# EAGLE design 2mbsimm (EAGLE 8.0.1)
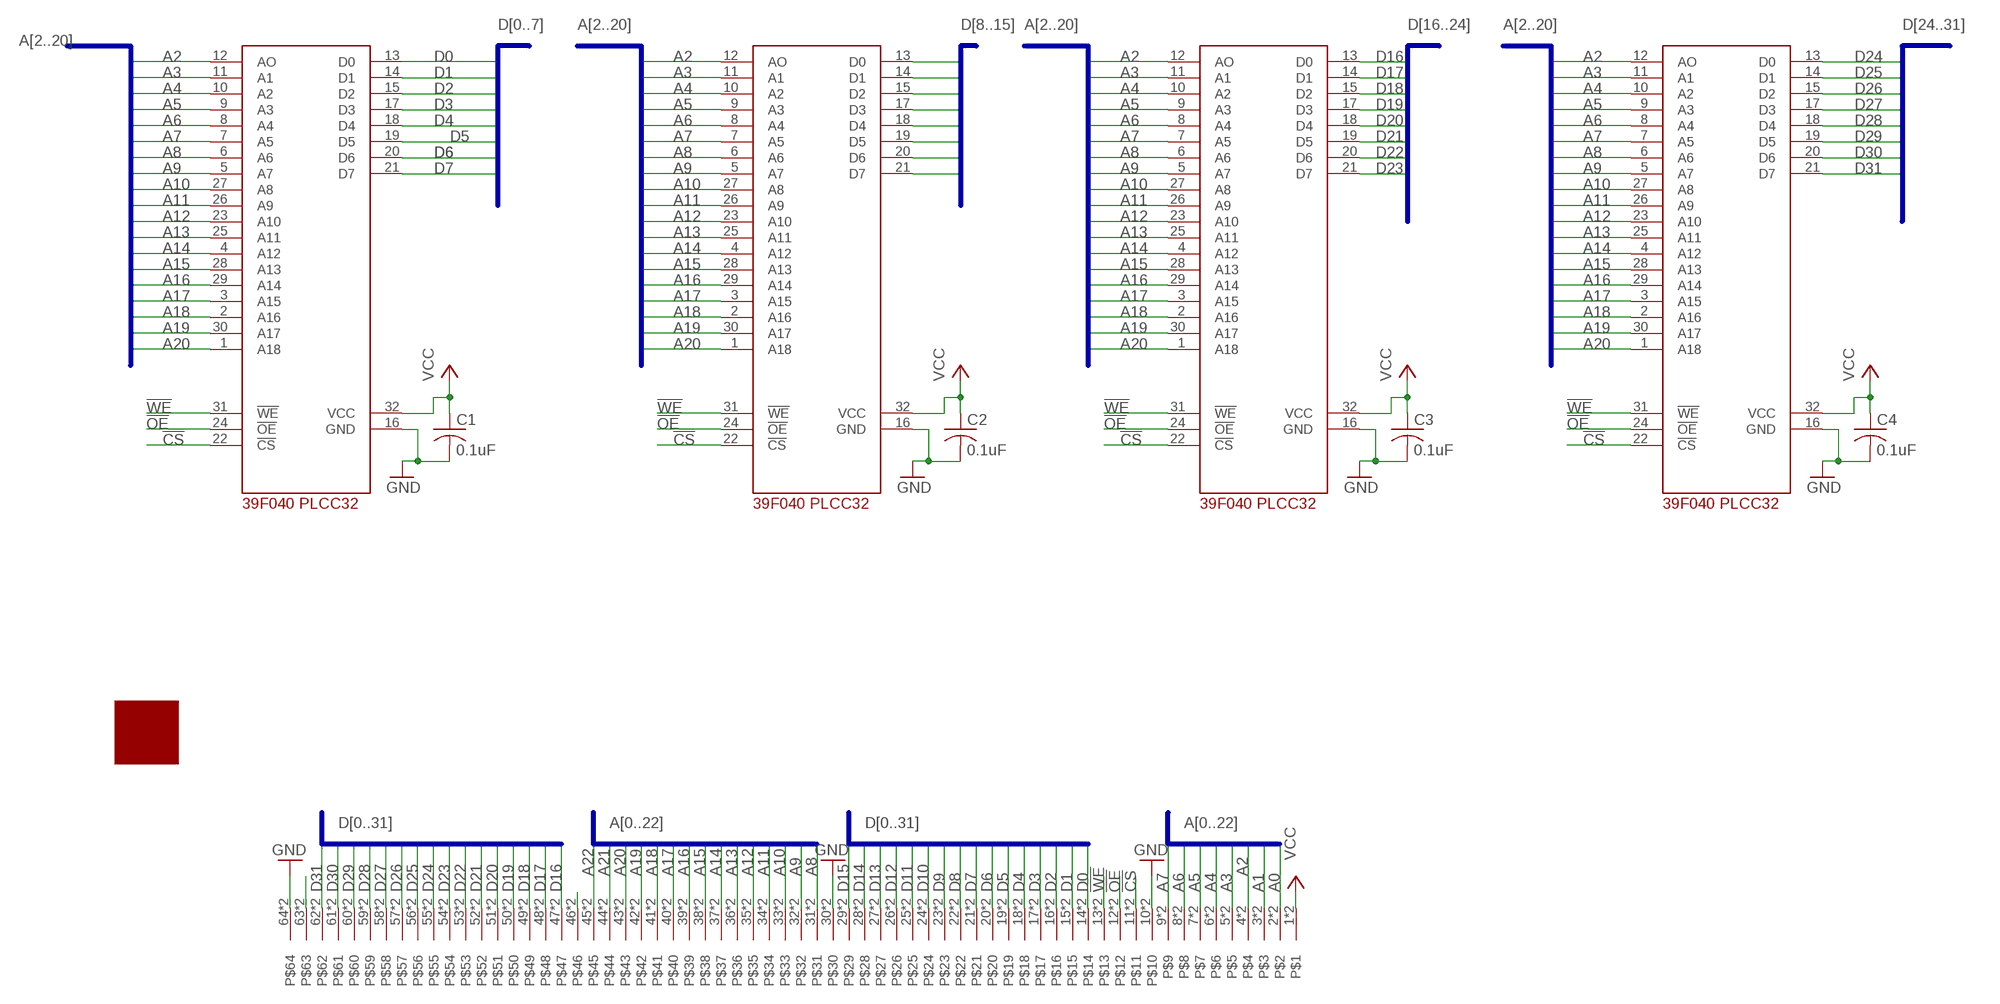
[diagram p0: schematic, sheet 1]

## Parts
C1  0.1uF  C-USC1206  [C1206]
C2  0.1uF  C-USC1206  [C1206]
C3  0.1uF  C-USC1206  [C1206]
C4  0.1uF  C-USC1206  [C1206]
CON1  MYSIMM  [SIMM64L]
U$1  39F040-PLCC-SOCKET  [PLCC-32-SMT-TT]
U$2  39F040-PLCC-SOCKET  [PLCC-32-SMT-TT]
U$3  39F040-PLCC-SOCKET  [PLCC-32-SMT-TT]
U$4  39F040-PLCC-SOCKET  [PLCC-32-SMT-TT]
U$5  LOGO  [LOGO]

## Nets
!CS: CON1.11 CON1.75 U$1.22(!CS) U$2.22(!CS) U$3.22(!CS) U$4.22(!CS)
!OE: CON1.12 CON1.76 U$1.24(!OE) U$2.24(!OE) U$3.24(!OE) U$4.24(!OE)
!WE: CON1.13 CON1.77 U$1.31(!WE) U$2.31(!WE) U$3.31(!WE) U$4.31(!WE)
A0: CON1.2 CON1.66
A1: CON1.3 CON1.67
A2: CON1.4 CON1.68 U$1.12(AO) U$2.12(AO) U$3.12(AO) U$4.12(AO)
A3: CON1.5 CON1.69 U$1.11(A1) U$2.11(A1) U$3.11(A1) U$4.11(A1)
A4: CON1.6 CON1.70 U$1.10(A2) U$2.10(A2) U$3.10(A2) U$4.10(A2)
A5: CON1.7 CON1.71 U$1.9(A3) U$2.9(A3) U$3.9(A3) U$4.9(A3)
A6: CON1.8 CON1.72 U$1.8(A4) U$2.8(A4) U$3.8(A4) U$4.8(A4)
A7: CON1.9 CON1.73 U$1.7(A5) U$2.7(A5) U$3.7(A5) U$4.7(A5)
A8: CON1.31 CON1.95 U$1.6(A6) U$2.6(A6) U$3.6(A6) U$4.6(A6)
A9: CON1.32 CON1.96 U$1.5(A7) U$2.5(A7) U$3.5(A7) U$4.5(A7)
A10: CON1.33 CON1.97 U$1.27(A8) U$2.27(A8) U$3.27(A8) U$4.27(A8)
A11: CON1.34 CON1.98 U$1.26(A9) U$2.26(A9) U$3.26(A9) U$4.26(A9)
A12: CON1.35 CON1.99 U$1.23(A10) U$2.23(A10) U$3.23(A10) U$4.23(A10)
A13: CON1.36 CON1.100 U$1.25(A11) U$2.25(A11) U$3.25(A11) U$4.25(A11)
A14: CON1.37 CON1.101 U$1.4(A12) U$2.4(A12) U$3.4(A12) U$4.4(A12)
A15: CON1.38 CON1.102 U$1.28(A13) U$2.28(A13) U$3.28(A13) U$4.28(A13)
A16: CON1.39 CON1.103 U$1.29(A14) U$2.29(A14) U$3.29(A14) U$4.29(A14)
A17: CON1.40 CON1.104 U$1.3(A15) U$2.3(A15) U$3.3(A15) U$4.3(A15)
A18: CON1.41 CON1.105 U$1.2(A16) U$2.2(A16) U$3.2(A16) U$4.2(A16)
A19: CON1.42 CON1.106 U$1.30(A17) U$2.30(A17) U$3.30(A17) U$4.30(A17)
A20: CON1.43 CON1.107 U$1.1(A18) U$2.1(A18) U$3.1(A18) U$4.1(A18)
A21: CON1.44 CON1.108
A22: CON1.45 CON1.109
D0: CON1.14 CON1.78 U$1.13(D0)
D1: CON1.15 CON1.79 U$1.14(D1)
D2: CON1.16 CON1.80 U$1.15(D2)
D3: CON1.17 CON1.81 U$1.17(D3)
D4: CON1.18 CON1.82 U$1.18(D4)
D5: CON1.19 CON1.83 U$1.19(D5)
D6: CON1.20 CON1.84 U$1.20(D6)
D7: CON1.21 CON1.85 U$1.21(D7)
D8: CON1.22 CON1.86 U$2.13(D0)
D9: CON1.23 CON1.87 U$2.14(D1)
D10: CON1.24 CON1.88 U$2.15(D2)
D11: CON1.25 CON1.89 U$2.17(D3)
D12: CON1.26 CON1.90 U$2.18(D4)
D13: CON1.27 CON1.91 U$2.19(D5)
D14: CON1.28 CON1.92 U$2.20(D6)
D15: CON1.29 CON1.93 U$2.21(D7)
D16: CON1.47 CON1.111 U$3.13(D0)
D17: CON1.48 CON1.112 U$3.14(D1)
D18: CON1.49 CON1.113 U$3.15(D2)
D19: CON1.50 CON1.114 U$3.17(D3)
D20: CON1.51 CON1.115 U$3.18(D4)
D21: CON1.52 CON1.116 U$3.19(D5)
D22: CON1.53 CON1.117 U$3.20(D6)
D23: CON1.54 CON1.118 U$3.21(D7)
D24: CON1.55 CON1.119 U$4.13(D0)
D25: CON1.56 CON1.120 U$4.14(D1)
D26: CON1.57 CON1.121 U$4.15(D2)
D27: CON1.58 CON1.122 U$4.17(D3)
D28: CON1.59 CON1.123 U$4.18(D4)
D29: CON1.60 CON1.124 U$4.19(D5)
D30: CON1.61 CON1.125 U$4.20(D6)
D31: CON1.62 CON1.126 U$4.21(D7)
GND [thicker]: C1.2 C2.2 C3.2 C4.2 CON1.10 CON1.30 CON1.64 CON1.74 CON1.94 CON1.128 U$1.16(GND) U$2.16(GND) U$3.16(GND) U$4.16(GND)
N$1 [thicker]: CON1.46 CON1.110
UNUSED3: CON1.63 CON1.127
VCC [thicker]: C1.1 C2.1 C3.1 C4.1 CON1.1 CON1.65 U$1.32(VCC) U$2.32(VCC) U$3.32(VCC) U$4.32(VCC)

## Buses
A[0..22]
D[0..31]
A[2..20]
D[0..7]
D[8..15]
D[16..24]
D[24..31]

## Library data of the parts
C1-C4 = resistor:C-US: CAPACITOR, American symbol
CON1 = Doug:MYSIMM: 64-Pin SIMM
U$1-U$4 = capstuff:39F040-PLCC-SOCKET: 4MB Flash in Plcc socket
U$5 = capstuff:LOGO

## Net classes
0 default: width 0.178 mm, drill 0.305 mm, clearance 0.178 mm
1 thicker: width 0.305 mm, drill 0.305 mm, clearance 0.178 mm

## Board
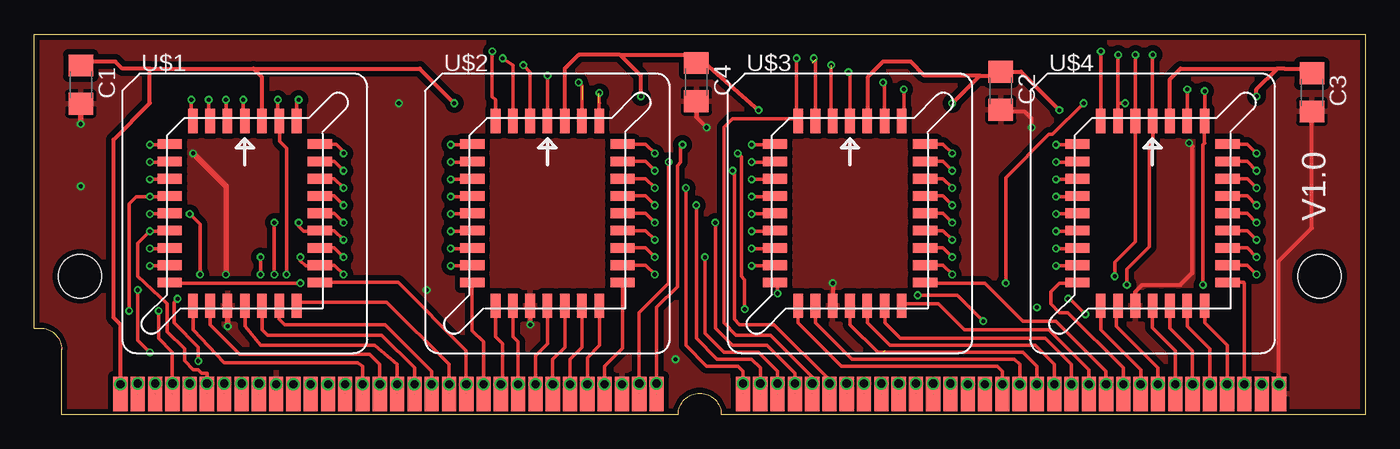
[diagram p1: board, top side]
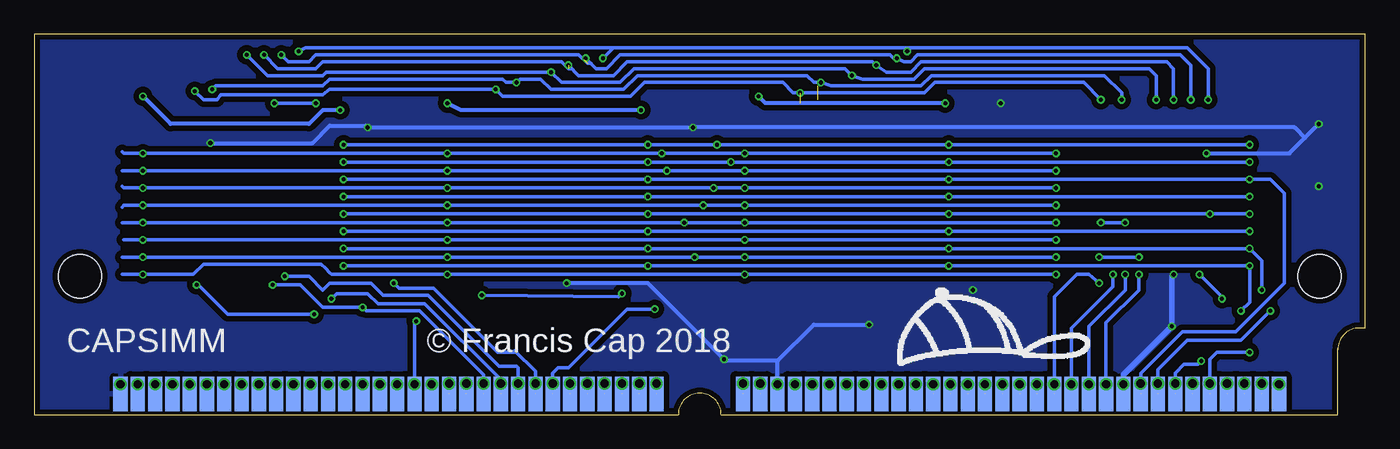
[diagram p2: board, bottom side, seen from below]

Size 97.79 x 27.94 mm. Coordinates in mm from the lower left corner, seen from the top.
Copper layers (1*16): Top 0.035559375mm / dielectric 1.6mm / Bottom 0.035559375mm
Design rules "oshpark-2layer": minimum track width 6mil, minimum drill 10mil, track to track 6mil, track to pad 6mil, pad to pad 6mil, via to via 6mil, smd to smd 6mil, copper to edge 15mil, drill to drill 6mil, minimum pad ring 5mil, minimum via ring 5mil, stop-mask expansion 2.5mil, vias tented up to drill 0mil, thermal gap 10mil

### Footprints (pad centres in the part's own frame; a part is rotated, then mirrored left to right if it is on the bottom)
C1206 = smd 1.6 x 1.8: 1 -1.4,0; 2 1.4,0
SIMM64L = smd 1.041 x 2.54: 1 -42.545,-8.636; 2 -41.275,-8.636; 3 -40.005,-8.636; 4 -38.735,-8.636; 5 -37.465,-8.636; 6 -36.195,-8.636; 7 -34.925,-8.636; 8 -33.655,-8.636; 9 -32.385,-8.636; 10 -31.115,-8.636; 11 -29.845,-8.636; 12 -28.575,-8.636; 13 -27.305,-8.636; 14 -26.035,-8.636; 15 -24.765,-8.636; 16 -23.495,-8.636; 17 -22.225,-8.636; 18 -20.955,-8.636; 19 -19.685,-8.636; 20 -18.415,-8.636; 21 -17.145,-8.636; 22 -15.875,-8.636; 23 -14.605,-8.636; 24 -13.335,-8.636; 25 -12.065,-8.636; 26 -10.795,-8.636; 27 -9.525,-8.636; 28 -8.255,-8.636; 29 -6.985,-8.636; 30 -5.715,-8.636; 31 -4.445,-8.636; 32 -3.175,-8.636; 33 3.175,-8.636; 34 4.445,-8.636; 35 5.715,-8.636; 36 6.985,-8.636; 37 8.255,-8.636; 38 9.525,-8.636; 39 10.795,-8.636; 40 12.065,-8.636; 41 13.335,-8.636; 42 14.605,-8.636; 43 15.875,-8.636; 44 17.145,-8.636; 45 18.415,-8.636; 46 19.685,-8.636; 47 20.955,-8.636; 48 22.225,-8.636; 49 23.495,-8.636; 50 24.765,-8.636; 51 26.035,-8.636; 52 27.305,-8.636; 53 28.575,-8.636; 54 29.845,-8.636; 55 31.115,-8.636; 56 32.385,-8.636; 57 33.655,-8.636; 58 34.925,-8.636; 59 36.195,-8.636; 60 37.465,-8.636; 61 38.735,-8.636; 62 40.005,-8.636; 63 41.275,-8.636; 64 42.545,-8.636 | smd 1.041 x 2.54 bottom: 65 -42.545,-8.636; 66 -41.275,-8.636; 67 -40.005,-8.636; 68 -38.735,-8.636; 69 -37.465,-8.636; 70 -36.195,-8.636; 71 -34.925,-8.636; 72 -33.655,-8.636; 73 -32.385,-8.636; 74 -31.115,-8.636; 75 -29.845,-8.636; 76 -28.575,-8.636; 77 -27.305,-8.636; 78 -26.035,-8.636; 79 -24.765,-8.636; 80 -23.495,-8.636; 81 -22.225,-8.636; 82 -20.955,-8.636; 83 -19.685,-8.636; 84 -18.415,-8.636; 85 -17.145,-8.636; 86 -15.875,-8.636; 87 -14.605,-8.636; 88 -13.335,-8.636; 89 -12.065,-8.636; 90 -10.795,-8.636; 91 -9.525,-8.636; 92 -8.255,-8.636; 93 -6.985,-8.636; 94 -5.715,-8.636; 95 -4.445,-8.636; 96 -3.175,-8.636; 97 3.175,-8.636; 98 4.445,-8.636; 99 5.715,-8.636; 100 6.985,-8.636; 101 8.255,-8.636; 102 9.525,-8.636; 103 10.795,-8.636; 104 12.065,-8.636; 105 13.335,-8.636; 106 14.605,-8.636; 107 15.875,-8.636; 108 17.145,-8.636; 109 18.415,-8.636; 110 19.685,-8.636; 111 20.955,-8.636; 112 22.225,-8.636; 113 23.495,-8.636; 114 24.765,-8.636; 115 26.035,-8.636; 116 27.305,-8.636; 117 28.575,-8.636; 118 29.845,-8.636; 119 31.115,-8.636; 120 32.385,-8.636; 121 33.655,-8.636; 122 34.925,-8.636; 123 36.195,-8.636; 124 37.465,-8.636; 125 38.735,-8.636; 126 40.005,-8.636; 127 41.275,-8.636; 128 42.545,-8.636 | hole 3.175: 45.517,0; -45.517,0
PLCC-32-SMT-TT = smd 0.71 x 1.78: 1 0,6.785; 2 -1.27,6.785; 3 -2.54,6.785; 4 -3.81,6.785; 14 -3.81,-6.785; 15 -2.54,-6.785; 16 -1.27,-6.785; 17 0,-6.785; 18 1.27,-6.785; 19 2.54,-6.785; 20 3.81,-6.785; 30 3.81,6.785; 31 2.54,6.785; 32 1.27,6.785 | smd 1.78 x 0.71: 5 -5.515,5.08; 6 -5.515,3.81; 7 -5.515,2.54; 8 -5.515,1.27; 9 -5.515,0; 10 -5.515,-1.27; 11 -5.515,-2.54; 12 -5.515,-3.81; 13 -5.515,-5.08; 21 5.515,-5.08; 22 5.515,-3.81; 23 5.515,-2.54; 24 5.515,-1.27; 25 5.515,0; 26 5.515,1.27; 27 5.515,2.54; 28 5.515,3.81; 29 5.515,5.08

### Placement (x,y rotation side)
C1  3.44,24.23 270 top
C2  71,23.78 270 top
C3  93.86,23.65 270 top
C4  48.65,24.42 270 top
CON1  48.9,10.16 0 top
U$1  15.48,14.78 0 top
U$2  37.7,14.78 0 top
U$3  59.93,14.78 0 top
U$4  82.15,14.78 0 top
U$5  34.42,3.56 0 bottom

### Tracks (layer width: path | path; a pad name or v marks a point on that pad's centre or on a via)
!CS  (via drill 0.3 pad 0.25, 0.6)
  Top 0.254: v22.73,10.29 22.05,10.97 U$1.22 20.95,10.92 19.94,10.92 19.56,11.3 v19.56,11.56 | U$2.22 44.91,10.97 v45.59,10.29 | U$3.22 66.75,10.97 v67.44,10.29 | U$4.22 89.11,10.97 v89.79,10.29 | v16.64,10.29 v16.64,11.56
  Top 0.406: CON1.75 v19.05,2.22
  Bottom 0.254: v22.73,10.29 v45.59,10.29 v67.44,10.29 75.95,10.29 76.07,10.41 76.39,10.73 76.71,11.05 85.34,11.05 86.11,10.29 v89.79,10.29 91.31,10.29 | CON1.75 19.05,6.73 16.64,9.14 v16.64,10.29 | v16.64,11.56 v19.56,11.56
  Bottom 0.305: v19.05,2.22 CON1.75
!OE  (via drill 0.3 pad 0.25, 0.6)
  Top 0.178: 20.16,2.38 v20.32,2.22
  Top 0.254: v22.73,12.83 22.05,13.51 U$1.24 20.95,13.46 19.81,13.46 19.43,13.84 v19.43,14.1 | U$2.24 44.91,13.51 v45.59,12.83 | U$3.24 66.75,13.51 v67.44,12.83 | U$4.24 89.11,13.51 v89.79,12.83 | v17.65,10.29 v17.65,14.1
  Top 0.406: CON1.76 v20.32,2.22
  Bottom 0.178: v20.32,2.22 20.32,2.54
  Bottom 0.254: v22.73,12.83 v45.59,12.83 v67.44,12.83 v89.79,12.83 91.19,12.83 | CON1.76 20.32,6.48 17.65,9.14 v17.65,10.29 | v17.65,14.1 v19.43,14.1
  Bottom 0.305: v20.32,2.22 CON1.76
!WE  (via drill 0.3 pad 0.25, 0.6)  (1 unrouted)
  Top 0.254: v17.91,23.11 17.91,21.68 U$1.31 18.03,21.55 18.03,20.07 18.54,19.56 v18.54,10.29 | v40.01,24.38 40.26,24.13 40.26,21.58 U$2.31 | 40.26,22.86 40.24,23.1 | U$3.31 62.47,24.27 v62.36,24.38 | 84.71,21.58 U$4.31 84.71,21.58 | v84.71,23.88 84.71,21.58
  Top 0.406: CON1.77 v21.59,2.22
  Bottom 0.254: v21.59,2.22 21.72,2.35 | v17.91,23.11 17.91,23.62 19.18,24.89 31.88,24.89 32.64,24.13 39.24,24.13 v40.01,24.38 40.51,24.38 41.02,24.89 53.47,24.89 54.48,23.88 59.82,23.88 60.58,24.64 62.1,24.64 v62.36,24.38 63.12,24.38 63.37,24.64 76.07,24.64 76.58,24.13 84.46,24.13 v84.71,23.88 | CON1.77 21.59,6.35 18.54,9.4 v18.54,10.29
  Bottom 0.305: v21.59,2.22 CON1.77
A0  (1 unrouted)
A1  (1 unrouted)
A2  (via drill 0.3 pad 0.25, 0.6 pad 0.25)  (1 unrouted)
  Top 0.254: U$1.12 9.92,10.92 v8.51,10.92 | U$2.12 32.14,10.92 v30.61,10.92 | U$3.12 54.41,10.92 v52.71,10.92 | U$4.12 76.64,10.92 v75.06,10.92 | CON1.4 v10.16,2.29 10.16,4.57 9.14,5.59 v9.14,7.62
  Bottom 0.254: 8.51,10.67 v8.51,10.92 | v8.51,10.92 v30.61,10.92 | v30.61,10.92 31.37,10.92 | v30.61,10.92 v52.71,10.92 v75.06,10.92 | v8.51,10.92 8.51,8.26 v9.14,7.62
A3  (via drill 0.3 pad 0.25, 0.6 pad 0.25)  (1 unrouted)
  Top 0.254: U$1.11 9.92,12.19 v8.51,12.19 | U$2.11 32.14,12.19 v30.61,12.19 | U$3.11 54.41,12.19 v52.71,12.19 | U$4.11 76.64,12.19 v75.06,12.19 | CON1.69 v11.43,2.29 | v7.62,9.14 7.62,5.46 v8.51,4.57
  Bottom 0.254: v30.61,12.19 v8.51,12.19 7.62,11.3 v7.62,9.14 | 31.37,12.19 v30.61,12.19 | v30.61,12.19 v52.71,12.19 v75.06,12.19 | v8.51,4.57 10.92,4.57 11.43,4.06 v11.43,2.29
A4  (via drill 0.3 pad 0.25, 0.6 pad 0.25)  (1 unrouted)
  Top 0.254: U$1.10 9.92,13.46 v8.51,13.46 7.62,12.57 7.62,10.16 9.78,8.13 9.78,6.1 11.05,4.83 11.05,3.94 11.68,3.3 12.07,3.3 12.32,3.05 12.7,3.05 v12.7,2.29 CON1.70 | U$3.10 54.41,13.46 v52.71,13.46 | U$4.10 76.64,13.46 v75.06,13.46 | 32.14,13.46 U$2.10 32.19,13.46 v30.61,13.46 32.14,13.46
  Bottom 0.254: v8.51,13.46 v30.61,13.46 v52.71,13.46 v75.06,13.46
A5  (via drill 0.3 pad 0.25, 0.6 pad 0.25)  (1 unrouted)
  Top 0.254: U$1.9 9.92,14.73 v8.51,14.73 | U$2.9 32.14,14.73 v30.61,14.73 | U$3.9 54.41,14.73 v52.71,14.73 | U$4.9 76.64,14.73 v75.06,14.73 | v12.07,3.94 12.07,4.95 10.29,6.73 10.29,8.26 v10.54,8.51 | v12.19,10.29 12.19,13.97 v11.43,14.73
  Bottom 0.254: v8.51,14.73 v11.43,14.73 v30.61,14.73 | 31.37,14.73 v30.61,14.73 | v30.61,14.73 v52.71,14.73 v75.06,14.73 | v13.97,2.29 CON1.71 13.97,3.05 13.34,3.68 12.32,3.68 v12.07,3.94 | v10.54,8.51 10.54,8.64 v12.19,10.29
A6  (via drill 0.3 pad 0.25, 0.6 pad 0.25)  (1 unrouted)
  Top 0.254: U$1.8 9.92,16 v8.51,16 7.49,16 6.99,15.49 v6.99,7.62 | U$2.8 32.14,16 v30.61,16 | U$3.8 54.41,16 v52.71,16 | U$4.8 76.64,16 v75.06,16
  Bottom 0.254: v8.51,16 v30.61,16 v52.71,16 v75.06,16 | v15.24,2.29 CON1.72 | v15.24,2.29 15.24,3.05 | 15.24,3.05 15.24,3.3 13.08,5.46 9.14,5.46 v6.99,7.62 | 15.24,3.05 v15.24,2.29
A7  (via drill 0.3 pad 0.25, 0.6 pad 0.25)  (1 unrouted)
  Top 0.254: U$1.7 9.92,17.27 v8.51,17.27 | U$2.7 32.14,17.27 v30.61,17.27 | U$3.7 54.41,17.27 v52.71,17.27 | U$4.7 76.64,17.27 v75.06,17.27
  Bottom 0.254: v30.61,17.27 v8.51,17.27 6.99,17.27 5.97,16.26 5.97,9.65 9.53,6.1 13.46,6.1 16.51,3.05 v16.51,2.29 | 31.37,17.27 v30.61,17.27 | v30.61,17.27 v52.71,17.27 v75.06,17.27 | v16.51,2.29 CON1.73 v16.51,2.29
A8  (via drill 0.3 pad 0.25, 0.6 pad 0.25)  (1 unrouted)
  Top 0.254: U$1.6 9.92,18.54 v8.51,18.54 | U$2.6 32.14,18.54 v30.61,18.54 | U$3.6 54.41,18.54 v52.71,18.54 | U$4.6 76.64,18.54 v75.06,18.54 | v44.45,2.29 CON1.31 44.45,7.49 46.61,9.65 v46.61,18.54
  Bottom 0.254: v8.51,18.54 v30.61,18.54 | 31.37,18.54 v30.61,18.54 | v30.61,18.54 v46.61,18.54 v52.71,18.54 v75.06,18.54
A9  (via drill 0.3 pad 0.25, 0.6 pad 0.25)  (1 unrouted)
  Top 0.254: U$1.5 9.92,19.81 v8.51,19.81 | U$2.5 32.14,19.81 v30.61,19.81 | U$3.5 54.41,19.81 v52.71,19.81 | U$4.5 76.64,19.81 v75.06,19.81 | v45.72,2.29 CON1.96 45.72,7.87 47.24,9.4 47.24,18.29 47.5,18.54 47.5,19.68 v47.62,19.81
  Bottom 0.254: v8.51,19.81 v30.61,19.81 | 31.37,19.81 v30.61,19.81 | v30.61,19.81 v47.62,19.81 v52.71,19.81 v75.06,19.81
A10  (via drill 0.3 pad 0.25, 0.6 pad 0.25)  (1 unrouted)
  Top 0.254: U$1.27 22.05,17.32 v22.73,16.64 | U$2.27 44.91,17.32 v45.59,16.64 | U$3.27 66.75,17.32 v67.44,16.64 | U$4.27 89.11,17.32 v89.79,16.64 | v52.07,2.29 CON1.97 52.07,3.17 51.69,3.56 49.4,3.56 47.88,5.08 v47.88,16.64
  Bottom 0.254: v22.73,16.64 v45.59,16.64 v47.88,16.64 v67.44,16.64 v89.79,16.64 91.19,16.64 91.31,16.76
A11  (via drill 0.3 pad 0.25, 0.6 pad 0.25)  (1 unrouted)
  Top 0.254: U$1.26 22.05,16.05 v22.73,15.37 | U$2.26 44.91,16.05 v45.59,15.37 | U$3.26 66.75,16.05 v67.44,15.37 | U$4.26 89.11,16.05 v89.79,15.37 | CON1.98 53.34,3.43 52.71,4.06 50.16,4.06 48.64,5.59 v48.64,15.37
  Bottom 0.254: v22.73,15.37 v45.59,15.37 v48.64,15.37 v67.44,15.37 v89.79,15.37 91.19,15.37 91.31,15.24 | CON1.98 v53.34,2.29
A12  (via drill 0.3 pad 0.25, 0.6 pad 0.25)  (1 unrouted)
  Top 0.254: U$1.23 22.05,12.24 v22.73,11.56 | U$2.23 44.91,12.24 v45.59,11.56 | U$3.23 66.75,12.24 v67.44,11.56 | U$4.23 89.11,12.24 v89.79,11.56 | v54.61,2.29 CON1.99 54.61,3.17 53.21,4.57 50.67,4.57 49.28,5.97 v49.28,11.56
  Bottom 0.254: v22.73,11.56 v45.59,11.56 v49.28,11.56 v67.44,11.56 v89.79,11.56 91.31,11.56
A13  (via drill 0.3 pad 0.25, 0.6 pad 0.25)  (1 unrouted)
  Top 0.254: U$1.25 22.05,14.78 v22.73,14.1 | U$2.25 44.91,14.78 v45.59,14.1 | U$3.25 66.75,14.78 v67.44,14.1 | U$4.25 89.11,14.78 v89.79,14.1 | CON1.36 55.88,3.05 53.85,5.08 51.31,5.08 50.04,6.35 v50.04,14.1
  Bottom 0.254: v22.73,14.1 v45.59,14.1 v50.04,14.1 v67.44,14.1 v89.79,14.1 91.31,14.1 | CON1.36 v55.88,2.29
A14  (via drill 0.3 pad 0.25, 0.6 pad 0.25)  (1 unrouted)
  Top 0.254: U$1.4 11.56,21.68 v11.56,23.11 | v33.66,26.67 33.66,23.34 33.89,23.1 33.91,22.86 33.91,21.58 U$2.4 | v56.01,26.16 56.01,21.68 U$3.4 55.97,21.72 51.31,21.72 50.67,21.08 50.67,6.73 51.56,5.84 54.1,5.84 57.15,2.79 CON1.37 v57.15,2.29 | 78.36,21.58 U$4.4 78.34,26.65 v78.36,26.67
  Bottom 0.254: v11.56,23.11 11.56,25.4 13.08,26.92 33.4,26.92 | 33.4,26.92 v33.66,26.67 | 33.4,26.92 55.25,26.92 | 55.25,26.92 77.85,26.92 v78.36,26.67 | 55.25,26.92 v56.01,26.16
A15  (via drill 0.3 pad 0.25, 0.6 pad 0.25)  (1 unrouted)
  Top 0.254: U$1.28 22.05,18.59 v22.73,17.91 | U$2.28 44.91,18.59 v45.59,17.91 | U$3.28 66.75,18.59 v67.44,17.91 | U$4.28 89.11,18.59 v89.79,17.91 | CON1.38 58.42,2.54 54.36,6.6 51.82,6.6 51.44,6.99 51.44,17.65 v51.31,17.91
  Bottom 0.254: v22.73,17.91 v45.59,17.91 v51.31,17.91 v67.44,17.91 v89.79,17.91 91.31,17.91 | CON1.38 v58.42,2.29
A16  (via drill 0.3 pad 0.25, 0.6 pad 0.25)  (1 unrouted)
  Top 0.254: U$1.29 22.18,19.86 22.73,19.3 v22.73,19.18 | U$2.29 44.91,19.86 v45.59,19.18 | U$3.29 66.75,19.86 v67.44,19.18 | U$4.29 89.11,19.86 v89.79,19.18 | v52.2,7.75 52.2,9.91 51.94,10.16 51.94,18.92 v51.69,19.18
  Bottom 0.254: v22.73,19.18 v45.59,19.18 v51.69,19.18 v67.44,19.18 v89.79,19.18 91.19,19.18 91.31,19.3 | v59.69,2.29 CON1.39 59.69,3.05 59.31,3.43 58.55,3.43 54.23,7.75 v52.2,7.75
A17  (via drill 0.3 pad 0.25, 0.6 pad 0.25)  (3 unrouted)
  Top 0.254: U$1.3 12.83,21.68 v12.83,23.11 | v34.42,26.16 35.18,25.65 35.18,21.58 U$2.3 | U$3.3 57.39,26.05 v57.28,26.16 | 79.61,22.86 U$4.3 | 79.61,22.86 79.61,26.4 v79.63,26.42 | v71.37,9.65 71.37,17.4 74.55,20.57 74.8,20.57 v77.09,22.86 77.22,22.86 | v80.14,22.86 79.61,22.86
  Bottom 0.254: v12.83,23.11 12.83,25.65 13.59,26.42 32.89,26.42 33.4,25.91 33.91,25.91 v34.42,26.16 34.67,26.16 34.93,26.42 54.74,26.42 55.75,25.4 56.52,25.4 v57.28,26.16 | 56.9,25.78 57.15,25.78 57.79,26.42 77.09,26.42 77.6,25.91 79.12,25.91 v79.63,26.42 | v60.96,2.29 CON1.104 60.96,3.17 62.48,4.7 | 62.36,4.57 63.75,4.57 68.45,9.27 70.99,9.27 v71.37,9.65 | v77.09,22.86 v80.14,22.86
A18  (via drill 0.3 pad 0.25, 0.6 pad 0.25)  (2 unrouted)
  Top 0.254: U$1.2 14.1,21.68 v14.1,23.11 | v35.94,25.65 36.45,25.15 36.45,21.58 U$2.2 | v58.55,25.65 58.55,21.68 U$3.2 | v80.9,26.42 80.88,26.4 U$4.2 80.9,21.55 80.9,12.7 79.38,11.18 v79.38,10.16
  Bottom 0.254: v14.1,23.11 14.1,25.4 14.61,25.91 32.64,25.91 33.4,25.15 35.18,25.15 v35.94,25.65 36.2,25.91 54.23,25.91 55.25,24.89 57.79,24.89 v58.55,25.65 | 58.29,25.4 58.55,25.4 59.05,25.91 76.58,25.91 77.09,25.4 79.88,25.4 v80.9,26.42 | v62.23,2.29 CON1.41 62.23,3.43 62.36,3.56 63.63,3.56 68.83,8.76 72.14,8.76 73.03,9.65 76.07,9.65 76.58,9.14 77.6,10.16 v79.38,10.16
A19  (via drill 0.3 pad 0.25, 0.6 pad 0.25)  (2 unrouted)
  Top 0.254: 41.51,22.84 41.53,22.86 | U$1.30 19.29,22.97 v19.43,23.11 | U$2.30 41.51,23.61 v41.53,23.62 | v63.88,23.88 63.88,21.71 U$3.30 | v85.98,23.75 85.98,21.58 U$4.30 | v75.95,8.51 76.07,8.51 v77.22,7.37 | v85.85,9.53 85.85,19.81 85.98,19.94 85.96,19.95 U$4.30 | 85.98,21.55 U$4.30
  Bottom 0.254: v19.43,23.11 20.7,24.38 31.62,24.38 32.39,23.62 v41.53,23.62 42.04,23.62 42.8,24.38 52.96,24.38 53.98,23.37 63.37,23.37 v63.88,23.88 76.07,23.88 76.58,23.5 84.07,23.5 84.33,23.11 85.34,23.11 v85.98,23.75 | v63.5,2.29 CON1.42 63.5,2.54 69.09,8.13 72.52,8.13 73.28,8.89 75.56,8.89 v75.95,8.51 | v77.22,7.37 83.57,7.37 85.85,9.65 v85.85,9.53
A20  (via drill 0.3 pad 0.25, 0.6 pad 0.25)  (1 unrouted)
  Top 0.254: U$1.1 15.37,21.68 v15.37,23.11 | v37.72,24.89 37.72,21.58 U$2.1 | U$3.1 59.93,25.04 v59.82,25.15 | v82.17,26.42 82.15,26.4 U$4.1 82.17,21.55 82.17,20.19 81.91,19.94 81.91,12.32 80.26,10.67 v80.26,9.53
  Bottom 0.254: v15.37,23.11 15.37,24.89 15.88,25.4 32.39,25.4 33.15,24.64 36.96,24.64 v37.72,24.89 38.23,25.4 53.72,25.4 54.74,24.38 59.05,24.38 v59.82,25.15 76.33,25.15 76.58,24.89 80.65,24.89 v82.17,26.42 | v64.77,2.29 CON1.107 64.77,2.92 69.47,7.62 73.41,7.62 v73.66,7.87 76.58,7.87 78.23,9.53 v80.26,9.53
A21  (1 unrouted)
A22  (1 unrouted)
D0  (via drill 0.3 pad 0.25, 0.6)  (1 unrouted)
  Top 0.254: v19.56,9.65 10.01,9.65 U$1.13
  Top 0.406: CON1.78 v22.86,2.22
  Bottom 0.254: CON1.78 22.86,8.64 21.21,10.29 20.32,10.29 v19.56,9.65
D1  (via drill 0.6)  (1 unrouted)
  Top 0.254: CON1.79 24.13,3.56 23.75,3.81 13.97,3.81 11.68,6.22 11.68,7.11 11.67,7.13 U$1.14
  Top 0.406: v24.13,2.22 CON1.79
D2  (via drill 0.6)  (1 unrouted)
  Top 0.178: v25.4,2.22 25.4,2.46
  Top 0.254: CON1.80 25.4,3.68 24.64,4.45 15.11,4.45 12.95,6.6 12.95,7.98 U$1.15
  Top 0.406: v25.4,2.22 CON1.80
D3  (via drill 0.6)  (1 unrouted)
  Top 0.254: CON1.81 26.67,3.68 25.02,5.08 16.64,5.08 15.49,6.48 15.49,7.98 U$1.17
  Top 0.406: v26.67,2.22 CON1.81
D4  (via drill 0.6)  (1 unrouted)
  Top 0.254: CON1.82 27.94,3.43 25.53,5.84 17.15,5.84 16.75,6.24 U$1.18
  Top 0.406: v27.94,2.22 CON1.82
D5  (via drill 0.6)  (1 unrouted)
  Top 0.254: U$1.19 18.02,7 18.42,6.6 25.78,6.6 29.21,3.17 CON1.83
  Top 0.406: v29.21,2.22 CON1.83
D6  (via drill 0.6)  (1 unrouted)
  Top 0.254: CON1.84 30.48,3.68 25.91,8.26 19.55,8.26 U$1.20
  Top 0.406: v30.48,2.22 CON1.84
D7  (via drill 0.6)  (1 unrouted)
  Top 0.254: U$1.21 26.75,9.7 31.75,4.7 v31.75,2.22
  Top 0.406: v31.75,2.22 CON1.85
D8  (via drill 0.6)
  Top 0.254: U$2.13 32.19,6.17 33.02,5.33 v33.02,2.22
  Top 0.406: v33.02,2.22 CON1.86
  Bottom 0.305: CON1.86 v33.02,2.22
D9  (via drill 0.6)
  Top 0.254: U$2.14 33.89,5.73 34.42,5.21 34.42,2.35 v34.29,2.22
  Top 0.406: v34.29,2.22 CON1.87
  Bottom 0.305: CON1.87 v34.29,2.22
D10  (via drill 0.6)
  Top 0.254: CON1.88 35.56,5.33 35.18,5.71 35.18,7.98 U$2.15
  Top 0.406: v35.56,2.22 CON1.88
  Bottom 0.305: CON1.88 v35.56,2.22
D11  (via drill 0.6)
  Top 0.254: U$2.17 37.7,5.19 36.83,4.32 v36.83,2.22
  Top 0.406: v36.83,2.22 CON1.89
  Bottom 0.305: CON1.89 v36.83,2.22
D12  (via drill 0.6)
  Top 0.254: CON1.90 38.1,4.06 38.99,4.95 38.99,7.98 U$2.18
  Top 0.406: v38.1,2.22 CON1.90
  Bottom 0.305: CON1.90 v38.1,2.22
D13  (via drill 0.6)
  Top 0.178: v39.37,2.22 39.37,2.66
  Top 0.254: U$2.19 40.24,4.94 39.37,4.06 v39.37,2.22
  Top 0.406: v39.37,2.22 CON1.91
  Bottom 0.305: CON1.91 v39.37,2.22
D14  (via drill 0.6)
  Top 0.254: CON1.92 40.64,4.19 41.53,5.08 41.53,7.98 U$2.20
  Top 0.406: v40.64,2.22 CON1.92
  Bottom 0.305: CON1.92 v40.64,2.22
D15  (via drill 0.6)
  Top 0.254: U$2.21 43.22,4.86 41.91,3.56 v41.91,2.22
  Top 0.406: v41.91,2.22 CON1.93
  Bottom 0.305: CON1.93 v41.91,2.22
D16  (via drill 0.3 pad 0.25, 0.6)
  Top 0.178: v69.85,2.22 69.85,2.7
  Top 0.254: v54.61,8.89 54.61,9.5 U$3.13 | v69.72,6.86 67.82,8.76 v64.9,8.76
  Top 0.406: CON1.111 v69.85,2.22
  Bottom 0.254: v69.85,2.22 69.85,6.73 v69.72,6.86 | v64.9,8.76 54.86,8.64 v54.61,8.89
  Bottom 0.305: CON1.111 v69.85,2.22
D17  (via drill 0.6)
  Top 0.178: v71.12,2.22 71.12,2.62
  Top 0.254: U$3.14 56.12,6.75 59.31,3.56 70.74,3.56 71.12,3.17 v71.12,2.22
  Top 0.406: v71.12,2.22 CON1.112
  Bottom 0.305: CON1.112 v71.12,2.22
D18  (via drill 0.6)
  Top 0.254: CON1.113 72.39,3.68 72.01,4.06 60.07,4.06 57.4,6.73 57.4,7.98 U$3.15
  Top 0.406: v72.39,2.22 CON1.113
  Bottom 0.305: CON1.113 v72.39,2.22
D19  (via drill 0.6)
  Top 0.254: CON1.114 73.66,3.56 72.64,4.57 61.98,4.57 59.94,6.6 59.94,7.98 U$3.17
  Top 0.406: v73.66,2.22 CON1.114
  Bottom 0.305: CON1.114 v73.66,2.22
D20  (via drill 0.6)
  Top 0.254: CON1.115 74.93,3.68 73.53,5.08 62.87,5.08 61.21,6.73 61.21,7.98 U$3.18
  Top 0.406: v74.93,2.22 CON1.115
  Bottom 0.305: CON1.115 v74.93,2.22
D21  (via drill 0.6)
  Top 0.254: CON1.116 76.2,3.68 74.3,5.59 63.63,5.59 62.48,6.73 62.48,7.98 U$3.19
  Top 0.406: v76.2,2.22 CON1.116
  Bottom 0.305: CON1.116 v76.2,2.22
D22  (via drill 0.6)
  Top 0.254: CON1.117 77.47,3.3 74.55,6.22 68.33,6.22 66.42,8.13 63.87,8.13 U$3.20
  Top 0.406: v77.47,2.22 CON1.117
  Bottom 0.305: CON1.117 v77.47,2.22
D23  (via drill 0.6)
  Top 0.254: CON1.118 78.74,3.17 75.06,6.86 72.64,6.86 69.85,9.65 65.49,9.65 U$3.21
  Top 0.406: v78.74,2.22 CON1.118
  Bottom 0.305: CON1.118 v78.74,2.22
D24  (via drill 0.6)
  Top 0.254: CON1.119 80.01,3.43 75.95,7.49 75.31,7.49 74.68,8.13 74.68,9.02 75.31,9.65 76.59,9.65 U$4.13
  Top 0.406: v80.01,2.22 CON1.119
  Bottom 0.305: CON1.119 v80.01,2.22
D25  (via drill 0.6)
  Top 0.254: CON1.120 81.28,3.3 78.36,6.22 78.36,7.98 U$4.14
  Top 0.406: v81.28,2.22 CON1.120
  Bottom 0.305: CON1.120 v81.28,2.22
D26  (via drill 0.6)
  Top 0.254: CON1.121 82.55,3.43 79.5,6.48 79.5,7.88 U$4.15
  Top 0.406: v82.55,2.22 CON1.121
  Bottom 0.305: CON1.121 v82.55,2.22
D27  (via drill 0.6)
  Top 0.254: CON1.122 83.82,4.7 82.15,6.37 U$4.17
  Top 0.406: v83.82,2.22 CON1.122
  Bottom 0.305: CON1.122 v83.82,2.22
D28  (via drill 0.6)
  Top 0.254: CON1.123 85.09,4.7 83.44,6.35 83.44,7.98 U$4.18
  Top 0.406: v85.09,2.22 CON1.123
  Bottom 0.305: CON1.123 v85.09,2.22
D29  (via drill 0.6)
  Top 0.254: CON1.124 86.36,4.83 84.71,6.48 84.71,7.98 U$4.19
  Top 0.406: v86.36,2.22 CON1.124
  Bottom 0.305: CON1.124 v86.36,2.22
D30  (via drill 0.6)
  Top 0.254: CON1.125 87.63,5.08 85.98,6.73 85.98,7.98 U$4.20
  Top 0.406: v87.63,2.22 CON1.125
  Bottom 0.305: CON1.125 v87.63,2.22
D31  (via drill 0.6)
  Top 0.254: U$4.21 88.85,9.7 88.9,9.65 v88.9,2.22
  Top 0.406: v88.9,2.22 CON1.126
  Bottom 0.305: CON1.126 v88.9,2.22
GND  (via drill 0.3 pad 0.25, 0.6)
  Top 0.305: 43.18,2.52 v43.18,2.22 | U$2.16 36.43,6.62 v36.45,6.6 | CON1.128 91.44,11.3 93.85,13.72 93.85,22.25 C3.2 | C4.2 48.65,21.84 v49.4,21.08 | v73.28,21.08 73.28,21.72 72.77,22.23 71.16,22.23 C2.2 | v58.67,9.65 58.67,8.01 U$3.16 | U$4.16 80.88,9 81.41,9.53 84.2,9.53 85.09,10.41 85.09,19.68 v84.84,19.94
  Top 0.406: v91.44,2.22 CON1.128 | v17.78,2.22 CON1.74 | v43.18,2.22 CON1.94 | v14.22,6.48 14.22,7.98 U$1.16 | v14.1,10.29 14.1,16.76 v11.68,19.18 | v3.43,21.34 3.43,22.82 C1.2
  Bottom 0.305: v11.68,19.18 5.59,19.18 4.45,20.32 | 4.45,20.32 v3.43,21.34 | v36.45,6.6 40.51,6.6 43.18,3.94 | v43.18,2.22 43.18,3.94 | 4.45,20.32 5.21,21.08 v49.4,21.08 v73.28,21.08 73.41,21.21 76.07,21.21 77.34,19.94 v84.84,19.94 | 43.18,3.94 46.99,3.94 v47.12,4.06 52.71,9.65 v58.67,9.65
  Bottom 0.406: v17.78,2.22 17.78,2.92 v14.22,6.48 14.22,10.16 v14.1,10.29
  other vias: 3.43,16.76 26.8,22.86 28.83,9.14
  pour Top (isolate 0.406): 0.24,27.54 97.63,27.54 97.63,0.24 50.8,0.24 arc180 47.07,0.24 2.3,0.24 2.3,4.76 arc90 0.4,6.67 0.24,6.67
  pour Bottom (isolate 0.406): 0.24,27.54 97.63,27.54 97.63,0.24 50.8,0.24 arc180 47.07,0.24 2.3,0.24 2.3,4.76 arc90 0.4,6.67 0.24,6.67
N$1  (via drill 0.6)
  Top 0.406: CON1.110 v68.58,2.22
  Bottom 0.305: 68.45,2.46 68.5,2.41 CON1.110 v68.58,2.22
N$2  (via drill 0.6 pad 0.25)
  other vias: 7.62,2.29
N$3  (via drill 0.6 pad 0.25)
  other vias: 8.89,2.29
N$7  (via drill 0.6 pad 0.25)
  other vias: 67.31,2.29
N$8  (via drill 0.6 pad 0.25)
  other vias: 66.04,2.29
UNUSED3  (via drill 0.6)
  Top 0.406: v90.17,2.22 CON1.127
  Bottom 0.305: CON1.127 v90.17,2.22
VCC  (via drill 0.3 pad 0.25, 0.6)
  Top 0.305: U$1.32 16.75,24.78 16.13,25.4 8.51,25.4 | 8.51,25.4 8,25.4 6.48,25.4 5.97,25.91 3.72,25.91 C1.1 | U$2.32 38.97,25.38 40.01,26.42 43.05,26.42 | 43.05,26.42 48.05,26.42 C4.1 49.24,25.82 v53.21,22.35 | CON1.65 6.35,6.6 5.84,7.11 5.84,20.19 8.51,22.86 8.51,25.4 | 8.51,25.4 28.32,25.4 v30.86,22.86 | v44.58,23.37 44.58,24.89 43.05,26.42 | v67.44,22.86 69.47,24.89 | 69.47,24.89 70.71,24.89 C2.1 72.48,25.18 v75.31,22.35 | 69.47,24.89 65.41,24.89 64.39,25.91 62.36,25.91 61.21,24.77 61.21,21.58 U$3.32 | v89.79,23.37 89.79,23.88 91.31,25.4 | 91.31,25.4 91.82,25.4 93.52,25.4 C3.1 | U$4.32 83.42,24.62 84.2,25.4 91.31,25.4
  Top 0.406: v6.35,2.22 CON1.65 6.48,1.65
  Bottom 0.305: CON1.65 v6.35,2.22 | v30.86,22.86 44.07,22.86 v44.58,23.37 | v53.21,22.35 66.42,22.35 v67.44,22.86 | v75.31,22.35 76.58,22.35 77.6,21.34 87.76,21.34 v89.79,23.37

### Text on the board
tPlace: V1.0
bPlace: © Francis Cap 2018 | CAPSIMM